# EAGLE design yuniminMotorEncoders (EAGLE 4.11)
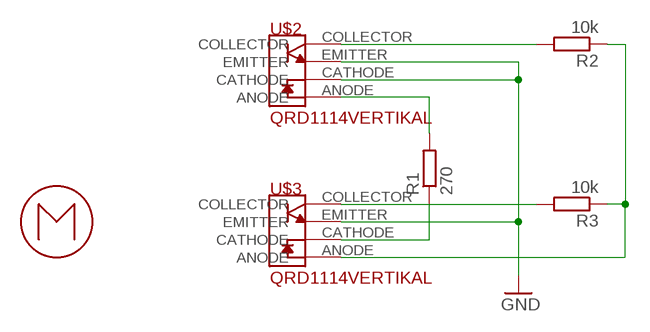
[diagram p0: schematic, sheet 1]

## Parts
R1  270  R-EU_R1206  [R1206]
R2  10k  R-EU_R1206  [R1206]
R3  10k  R-EU_R1206  [R1206]
U$1  MOTORGW8  [GW8LIN]
U$2  QRD1114VERTIKAL  [QRD1114V]
U$3  QRD1114VERTIKAL  [QRD1114V]

## Nets
GND: U$2.CATHODE U$2.EMITTER U$3.EMITTER
N$1: R1.2 U$2.ANODE
N$2: R1.1 U$3.CATHODE
S1: R2.2 U$2.COLLECTOR
S2: R3.2 U$3.COLLECTOR
VCC: R2.1 R3.1 U$3.ANODE

## Library data of the parts
R1-R3 = rcl:R-EU_: RESISTOR, European symbol
U$1 = motors:MOTORGW8
U$2 U$3 = sensor:QRD1114

## Board
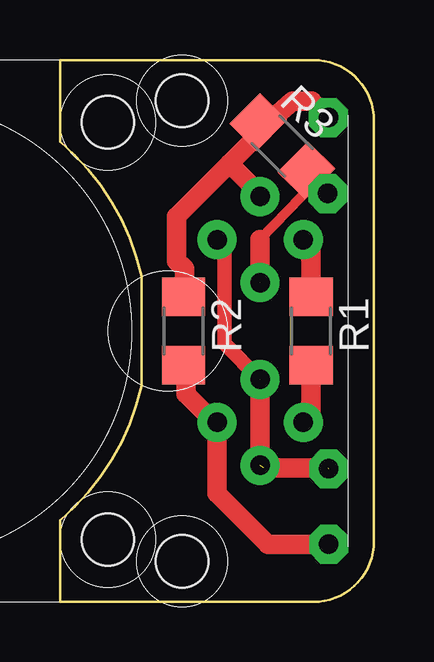
[diagram p1: board, top side]
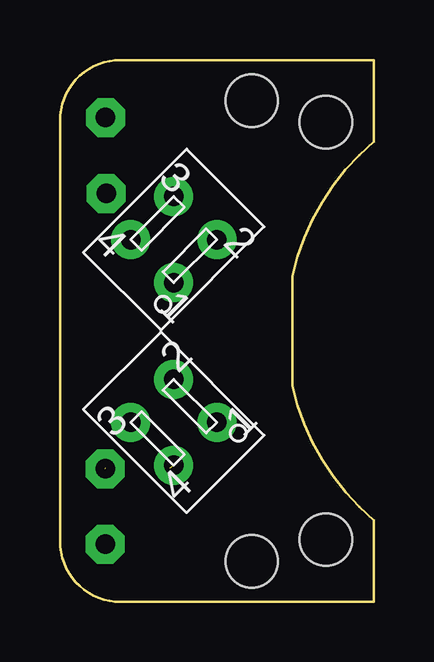
[diagram p2: board, bottom side, seen from below]

Size 13.1 x 22.6 mm. Coordinates in mm from the lower left corner, seen from the top.
Outline: 0,19.2 0,22.6 10.56,22.6 arc-90 13.1,20.06 13.1,2.54 arc-90 10.56,0 0,0 0,3.4 arc37 3.4,9 3.4,13.6 arc37 0,19.2
Copper layers (1*16): Top 0.035mm / dielectric 1.5mm / Bottom 0.035mm
Design rules "default": minimum track width 20mil, minimum drill 24mil, track to track 8mil, track to pad 8mil, pad to pad 8mil, via to via 8mil, smd to smd 8mil, copper to edge 1mil, drill to drill 8mil, minimum pad ring 10mil, minimum via ring 8mil, stop-mask expansion 4mil, vias tented up to drill 0mil, thermal gap 10mil
Holes 2.18 mm at 2,20 2,2.6 5.1,1.7 5.1,20.9

### Footprints (pad centres in the part's own frame; a part is rotated, then mirrored left to right if it is on the bottom)
R1206 = smd 1.6 x 1.803: 1 -1.422,0; 2 1.422,0
GW8LIN = hole 3.1: -8.2,8.75; -8.2,-8.75
QRD1114V = drill 0.813 round: ANODE 1.27,-1.27; CATHODE 1.27,1.27; COLLECTOR -1.27,1.27; EMITTER -1.27,-1.27

### Placement (x,y rotation side)
R1  10.48,11.3 270 top
R2  5.16,11.3 270 top
R3  9.27,19 315 top
U$1  -18,11.3 0 top  (outside the outline)
U$2  8.35,7.49 225 bottom
U$3  8.35,15.11 135 bottom

### Tracks (layer width: path | path; a pad name or v marks a point on that pad's centre or on a via)
GND  (via drill 0.81)  (3 unrouted)
  Top 0.61: U$3.EMITTER 6.86,14.8 6.86,10.77 U$2.EMITTER
  Top 0.813: U$2.CATHODE U$2.EMITTER | 8.5,5.6 11.2,5.6
  other vias: 11.21,5.55
N$1
  Top 0.813: U$2.ANODE 10.48,7.82 R1.2
N$2
  Top 0.813: U$3.CATHODE 10.48,14.68 R1.1
S1  (via drill 0.81)
  Top 0.61: U$2.COLLECTOR 6.45,7.49
  Top 0.813: 6.45,7.49 5.26,8.68 5.26,10.03 5.31,10.03 R2.2 | v11.21,2.41 8.67,2.41 6.56,4.52 U$2.COLLECTOR
S2  (via drill 0.81)  (1 unrouted)
  Top 0.406: 8.35,15.11 10.66,17.52
  Top 0.61: 10.66,17.52 R3.2
  Top 0.813: U$3.COLLECTOR 8.35,15.11 | R3.2 10.55,17.6 v11.17,17.03
VCC  (via drill 0.81)
  Top 0.813: R2.1 5.2,12.78 5.2,13.9 4.86,14.22 4.86,16.06 7.08,18.29 | 8.8,20.09 R3.1 | 8.8,20.09 8.49,19.69 7.08,18.29 | U$3.ANODE 8.35,17.02 7.08,18.29 | 8.8,20.09 9.7,20.89 10.51,20.89 v11.2,20.2